# Altium schematic sheet IO_Pwr_Clock.SchDoc
size A4; SheetNumber: 2; SheetTotal: 7
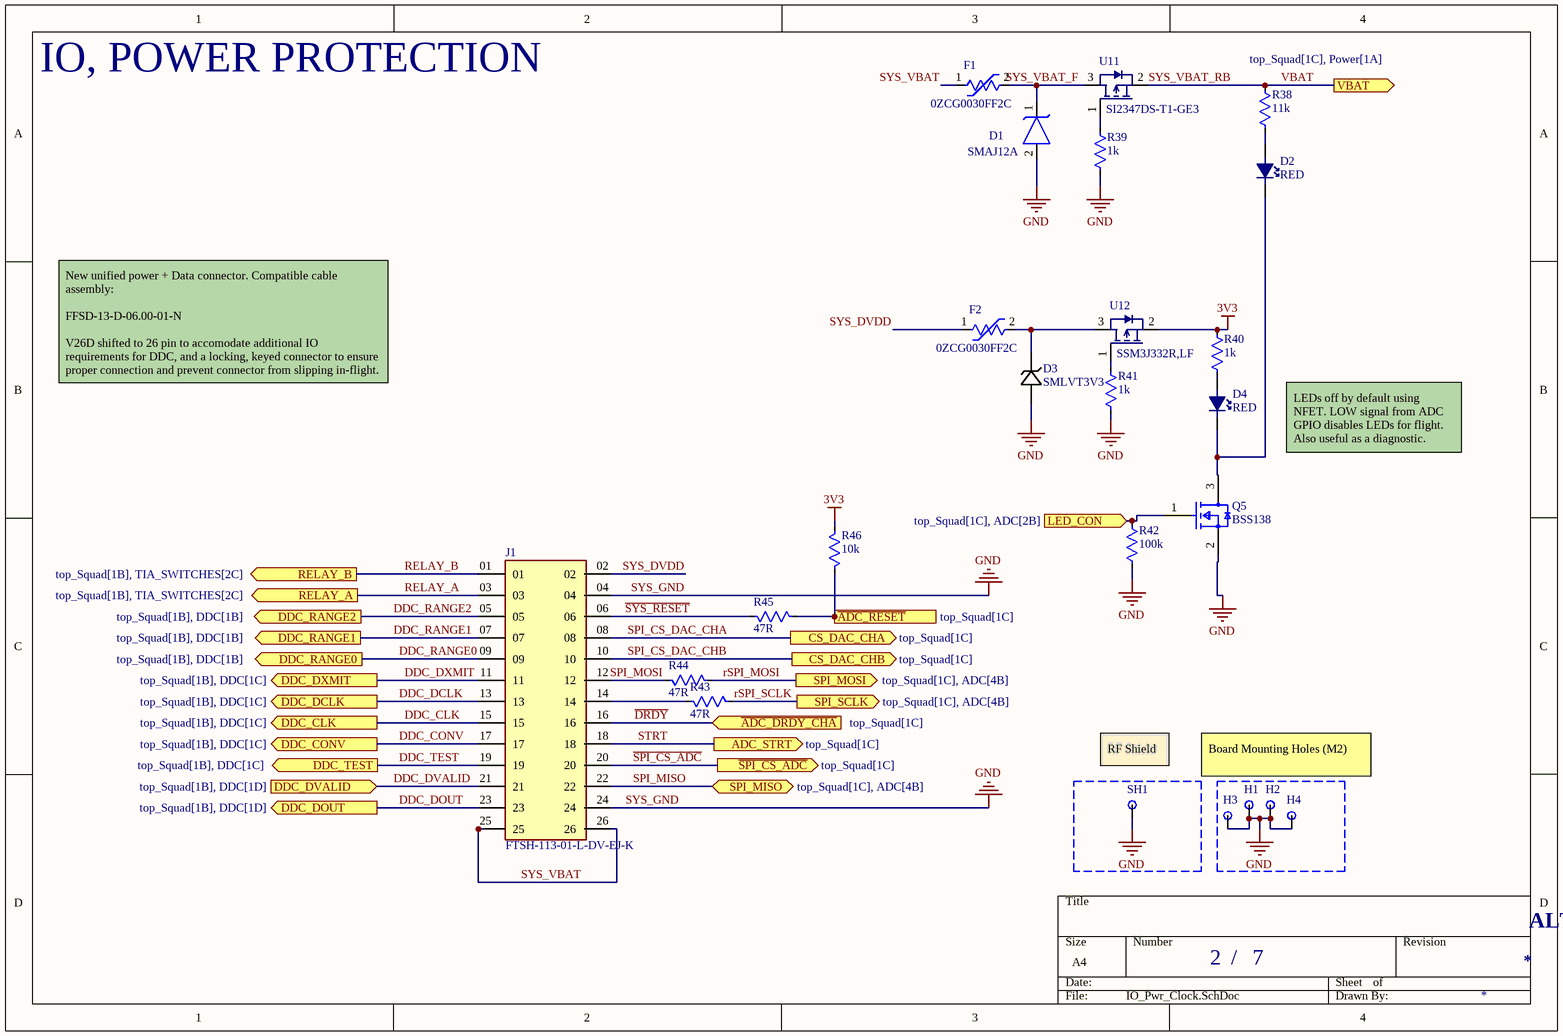
[diagram p0: IO_Pwr_Clock.SchDoc]

## Parts
D1  SMAJ12A  [DO-214AC SMA VISHAY]
D2  RED  [LED 0603 MID DENSITY]
D3  SMLVT3V3  [SMB_STM]
D4  RED  [LED 0603 MID DENSITY]
F1  0ZCG0030FF2C  [POLYFUSE 1812 NON-IPC BELFUSE]
F2  0ZCG0030FF2C  [POLYFUSE 1812 NON-IPC BELFUSE]
H1  Mount-hole  [M3 PTH FOR 4.5MM HEX]  (value not drawn)  (no BOM)
H2  Mount-hole  [M3 PTH FOR 4.5MM HEX]  (value not drawn)  (no BOM)
H3  Mount-hole  [M3 PTH FOR 4.5MM HEX]  (value not drawn)  (no BOM)
H4  Mount-hole  [M3 PTH FOR 4.5MM HEX]  (value not drawn)  (no BOM)
J1  FTSH-113-01-L-DV-EJ-K  [SAMTEC_FTSH-113-01-L-DV-EJ-K]
Q5  BSS138  [FP-318-08-IPC_B]
R38  11k  [RES 0603 IPC MID DENSITY]
R39  1k  [RES 0603 IPC MID DENSITY]
R40  1k  [RES 0603 IPC MID DENSITY]
R41  1k  [RES 0603 IPC MID DENSITY]
R42  100k  [RES 0603 IPC MID DENSITY]
R43  47R  [RES 0402 NON-IPC SEI]
R44  47R  [RES 0402 NON-IPC SEI]
R45  47R  [RES 0402 NON-IPC SEI]
R46  10k  [RES 0603 IPC MID DENSITY]
SH1  Mount-hole  [MS511-10]  (value not drawn)  (no BOM)
U11  SI2347DS-T1-GE3  [SOT95P245X110-3N]
U12  SSM3J332R,LF  [SOT95P245X110-3N]

## Ports
ADC_STRT (out, see top_Squad[1C]), CS_DAC_CHA (out, see top_Squad[1C]), CS_DAC_CHB (out, see top_Squad[1C]), DDC_CLK (out, see top_Squad[1B], DDC[1C]), DDC_CONV (out, see top_Squad[1B], DDC[1C]), DDC_DCLK (out, see top_Squad[1B], DDC[1C]), DDC_DOUT (out, see top_Squad[1B], DDC[1D]), DDC_DVALID (in, see top_Squad[1B], DDC[1D]), DDC_DXMIT (out, see top_Squad[1B], DDC[1C]), DDC_RANGE0 (out, see top_Squad[1B], DDC[1B]), DDC_RANGE1 (out, see top_Squad[1B], DDC[1B]), DDC_RANGE2 (out, see top_Squad[1B], DDC[1B]), DDC_TEST (out, see top_Squad[1B], DDC[1C]), LED_CON (in, see top_Squad[1C], ADC[2B]), RELAY_A (out, see top_Squad[1B], TIA_SWITCHES[2C]), RELAY_B (out, see top_Squad[1B], TIA_SWITCHES[2C]), SPI_MISO (bidir, see top_Squad[1C], ADC[4B]), SPI_MOSI (out, see top_Squad[1C], ADC[4B]), SPI_SCLK (out, see top_Squad[1C], ADC[4B]), VBAT (out, see top_Squad[1C], Power[1A]), ~{ADC_DRDY_CHA} (in, see top_Squad[1C]), ~{ADC_RESET} (out, see top_Squad[1C]), ~{SPI_CS_ADC} (out, see top_Squad[1C])

## Nets
3V3: R40.2 R46.1 U12.2(Source)
SYS_GND: D1.2(Anode) D3.2 H1.1 H2.1 H3.1 H4.1 J1.04 J1.24 Q5.2(S) R39.1 R41.1 R42.1 SH1.1  [also labelled GND]
~{ADC_RESET}: R45.2 R46.2 ; port ~{ADC_RESET}
~{DRDY}: J1.16 ; port ~{ADC_DRDY_CHA}
~{SPI_CS_ADC}: J1.20 ; port ~{SPI_CS_ADC}
~{SYS_RESET}: J1.06 R45.1
DDC_CLK: J1.15 ; port DDC_CLK
DDC_CONV: J1.17 ; port DDC_CONV
DDC_DCLK: J1.13 ; port DDC_DCLK
DDC_DOUT: J1.23 ; port DDC_DOUT
DDC_DVALID: J1.21 ; port DDC_DVALID
DDC_DXMIT: J1.11 ; port DDC_DXMIT
DDC_RANGE0: J1.09 ; port DDC_RANGE0
DDC_RANGE1: J1.07 ; port DDC_RANGE1
DDC_RANGE2: J1.05 ; port DDC_RANGE2
DDC_TEST: J1.19 ; port DDC_TEST
LED_CON: Q5.1(G) R42.2 ; port LED_CON
RELAY_A: J1.03 ; port RELAY_A
RELAY_B: J1.01 ; port RELAY_B
rSPI_MOSI: R44.2 ; port SPI_MOSI
rSPI_SCLK: R43.2 ; port SPI_SCLK
SPI_CS_DAC_CHA: J1.08 ; port CS_DAC_CHA
SPI_CS_DAC_CHB: J1.10 ; port CS_DAC_CHB
SPI_MISO: J1.22 ; port SPI_MISO
SPI_MOSI: J1.12 R44.1
STRT: J1.18 ; port ADC_STRT
SYS_DVDD: F2.1 J1.02
SYS_VBAT: F1.1 J1.25 J1.26
SYS_VBAT_F: D1.1(Cathode) F1.2 U11.3(Drain)
SYS_VBAT_RB: R38.2 U11.2(Source) ; port VBAT  [also labelled VBAT]
NetD2_1: D2.1 D4.1 Q5.3(D)
NetD2_2: D2.2 R38.1
NetD3_1: D3.1 F2.2 U12.3(Drain)
NetD4_2: D4.2 R40.1
NetJ1_14: J1.14 R43.1
NetR39_2: R39.2 U11.1(Gate)
NetR41_2: R41.2 U12.1(Gate)

## Notes on the sheet
- IO, POWER PROTECTION
- New unified power + Data connector. Compatible cable assembly:
  FFSD-13-D-06.00-01-N
  V26D shifted to 26 pin to accomodate additional IO requirements for DDC, and a locking, keyed connector to ensure proper connection and prevent connector from slipping in-flight.
- LEDs off by default using NFET. LOW signal from ADC GPIO disables LEDs for flight. Also useful as a diagnostic.
- (near SH1) RF Shield
- Board Mounting Holes (M2)
- /
- ALTAIR PhotoDiode ReadOut (PDRO) - Squad

## Library data of the parts
D1 = Zener: Vishay SMAJ12A-M3/61 - TVS Diode 12V Standoff 13.3V Breakdown DO-214AC; MF: Vishay General Semiconductor; MP: SMAJ12A-M3/61
D2 D4 = LED-blue: LED RED CLEAR 0603 SMD; Color: Blue; Luminous Intensity: 145mcd; Forward Current: 30mA; Forward Voltage: 3.2V; Wavelength: 470nm; Viewing Angle: 140°; Lens Style: Clear,Rectangular; Test Current: 20mA; MF: Wurth Electronics; MP: 150060RS75000; RoHS: Yes; Category: LEDs; Stock 1: 66561; Mount: Surface Mount; Case/Package: 0603; Case Code (Metric): 1608; Case Code (Imperial): 0603; Min Operating Temperature: -40°C; Max Operating Temperature: 85°C; Package Quantity: 4000; Packaging: Cut Tape; Dominant Wavelength: 470nm; Length: 1.6mm; Height: 0.7mm; Width: 0.8mm; REACH SVHC: Unknown; ComponentLink1URL: https://datasheet.ciiva.com/29563/150060bs75000-29563034.pdf?src-supplier=Digi-Key; ComponentLink1Description: https://datasheet.ciiva.com/29563/150060bs75000-29563034.pdf?src-supplier=Digi-Key; ComponentLink2URL: https://datasheet.ciiva.com/29279/759426-da-01-en-chipled-0603-w-kl-blau-150060bs75000-29279193.pdf?src-supplier=Conrad; ComponentLink2Description: https://datasheet.ciiva.com/29279/759426-da-01-en-chipled-0603-w-kl-blau-150060bs75000-29279193.pdf?src-supplier=Conrad; ComponentLink3URL: https://datasheet.ciiva.com/29563/150060bs75000-29563035.pdf?src-supplier=Digi-Key; ComponentLink3Description: https://datasheet.ciiva.com/29563/150060bs75000-29563035.pdf?src-supplier=Digi-Key; ComponentLink4URL: https://datasheet.ciiva.com/29563/150060bs75000-29563036.pdf?src-supplier=Digi-Key; ComponentLink4Description: https://datasheet.ciiva.com/29563/150060bs75000-29563036.pdf?src-supplier=Digi-Key; ComponentLink5URL: https://datasheet.ciiva.com/22656/1911343-22656939.pdf?src-supplier=Element14; ComponentLink5Description: https://datasheet.ciiva.com/22656/1911343-22656939.pdf?src-supplier=Element14; ComponentLink6URL: https://datasheet.ciiva.com/48430/150060bs75000-eng-tds-48430039.pdf?src-supplier=Distrelec; ComponentLink6Description: https://datasheet.ciiva.com/48430/150060bs75000-eng-tds-48430039.pdf?src-supplier=Distrelec; Supplier 1: Digi-Key; Supplier Part Number 1: 732-4966-1-ND
D3 = SMLVT3V3: 600 W, 3.3 V TVS in SMB; Manufacturer_Name: STMicroelectronics; Copyright: Copyright (C) 2025 Ultra Librarian. All rights reserved.; Manufacturer_Part_Number: SMLVT3V3; Refdes: Refdes
F1 F2 = Polyfuse: Bel Fuse 0ZCG0030FF2C - Polymeric PTC Resettable Fuse 30V 300mA hold 600mA trip SMD 1812; MF: Bel Fuse Inc.; MP: 0ZCG0030FF2C
H1-H4 SH1 = Mount-hole: (Plated) Mounting hole
Q5 = CMP-07173-000101-1: MOSFET N-CH 50V 220MA SOT-23; Turn-Off Delay Time: 20ns; Element Configuration: Single; Rds On Max: 3.5R; Gate to Source Voltage (Vgs): 20V; Threshold Voltage: 1.3V; Number of Elements: 1; Power Dissipation: 360mW; Rise Time: 9ns; Turn-On Delay Time: 2.5ns; Input Capacitance: 27pF; On-State Resistance: 6R; Lead Free: Lead Free; Length: 2.92mm; Width: 1.3mm; Drain to Source Breakdown Voltage: 50V; Min Operating Temperature: -55°C; REACH SVHC: No SVHC; Packaging: Tape and Reel; Radiation Hardening: No; Height: 0.93mm; Drain to Source Voltage (Vdss): 50V; Current Rating: 220mA; Voltage Rating (DC): 50V; Weight: 0.03g; Continuous Drain Current (ID): 220mA; Number of Pins: 3; Nominal Vgs: 1.3V; Max Power Dissipation: 360mW; Fall Time: 9ns; Drain to Source Resistance: 3.5R; Contact Plating: Tin; Case/Package: SOT-23; Package Quantity: 1; Dual Supply Voltage: 50V; Mount: Surface Mount; Termination: SMD/SMT; Max Operating Temperature: 150°C
R38 = RES: MF: Panasonic Electronic Components; MP: ERJ-U03F1001V
R39-R41 = RES: Panasonic ERJ-U03F1001V - Res SMD 1 kOhm 1% 1/10W 0603; MF: Panasonic Electronic Components; MP: ERJ-U03F1001V
R42 = RES: -55℃~+155℃ 100kΩ 100mW 75V Thick Film Resistor ±1% ±100ppm/℃ 0603 Chip Resistor - Surface Mount ROHS; MF: UNI-ROYAL(Uniroyal Elec); MP: 0603WAF1003T5E
R43-R45 = RES: Stackpole RMCF0402JT47R0 - Res 47Ohm 5% 0.063W 0402 Thick Film AEC-Q200 compliant; MF: Stackpole Electronics Inc.; MP: RMCF0402JT47R0
R46 = RES: Vishay CRCW060310K0FKEA SMD 0603 10k, CRCW e3 Series, 75V, thick film, 100mW; MF: Vishay Dale; MP: CRCW060310K0FKEA
U11 = PMOS: MOSFET P-CH 30V 5A SOT23-3; MF: Vishay Siliconix; Supplier 1: Avnet; Supplier Part Number 1: SI2347DS-T1-GE3; MP: SI2347DS-T1-GE3
U12 = PMOS_LV: P-Channel 30 V 6A (Ta) 1W (Ta) Surface Mount SOT-23F; MF: Toshiba; Supplier 1: Avnet; Supplier Part Number 1: SI2347DS-T1-GE3; MP: SSM3J332R,LF
J1 = FTSH-113-01-L-DV-EJ-K: Price: None; Value: *; Package: None; MP: FTSH-113-01-L-DV-EJ-K; Availability: Unavailable